# Altium project ThereMightBeNoise.PrjPCB (part 2 of 2)

## Sheet Power.SchDoc
size A3; Author: Danius Kalvaitis; Organization: Altium Limited; Address1: L3, 12a Rodborough Rd; Address2: Frenchs Forest; Address3: NSW; Address4: Australia 2086; DocumentNumber: 5; SheetNumber: 5; SheetTotal: 9
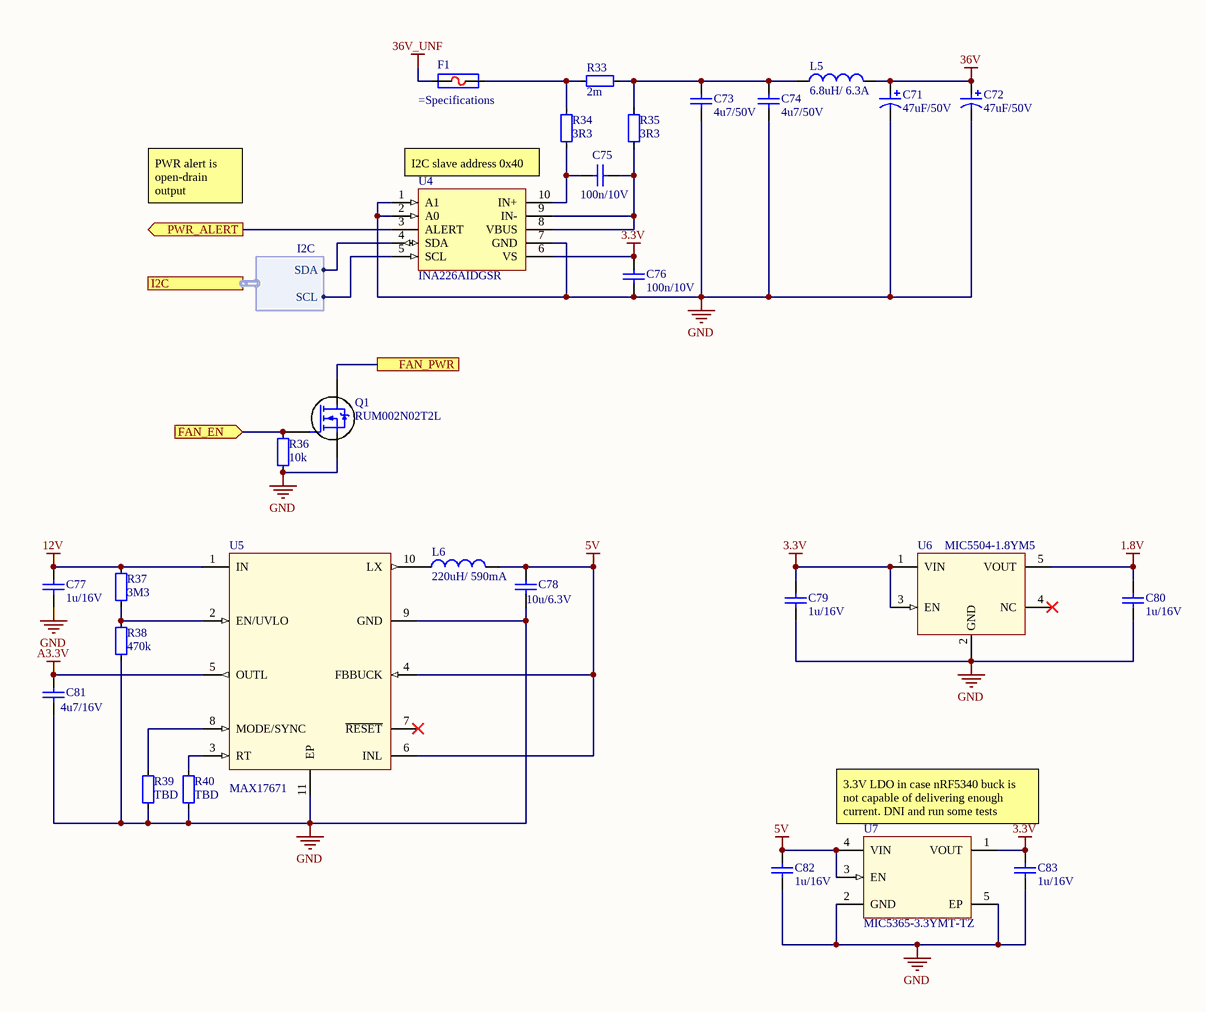
[diagram p6: Power.SchDoc]

### Parts
C71  47uF/50V  [WURTH-L6.5-D8]
C72  47uF/50V  [WURTH-L6.5-D8]
C73  4u7/50V  [C1210]
C74  4u7/50V  [C1210]
C75  100n/10V  [C0402]
C76  100n/10V  [C0402]
C77  1u/16V  [C0603]
C78  10u/6.3V  [C0805]
C79  1u/16V  [C0603]
C80  1u/16V  [C0603]
C81  4u7/16V  [C0805]
C82  1u/16V  [C0603]
C83  1u/16V  [C0603]
F1  (no value)  [F2512]
L5  6.8uH/ 6.3A  [SRR1260]
L6  220uH/ 590mA  [TYS6045221M-10]
Q1  RUM002N02T2L  [SOT-723-3]
R33  2m  [R1206]
R34  3R3  [R0402]
R35  3R3  [R0402]
R36  10k  [R0402]
R37  3M3  [R0402]
R38  470k  [R0402]
R39  TBD  [R0402]
R40  TBD  [R0402]
U4  INA226AIDGSR  [MSOP-10]
U5  MAX17671  [TDFN-10]
U6  MIC5504-1.8YM5  [SOT23-5]
U7  MIC5365-3.3YMT-TZ  [MLF-4]

### Ports
FAN_EN (in), FAN_PWR, I2C (harness I2C), PWR_ALERT (out)

### Harnesses
I2C: SCL, SDA

### Nets
1.8V: C80.2 U6.5(VOUT)
3.3V: C76.2 C79.2 C83.2 U4.6(VS) U6.1(VIN) U6.3(EN) U7.1(VOUT)
5V: C78.2 C82.2 L6.2 U5.4(FBBUCK) U5.6(INL) U7.3(EN) U7.4(VIN)
12V: C77.2 R37.2 U5.1(IN)
36V: C71.1 C72.1 L5.2
36V_UNF: F1.1
A3.3V: C81.2 U5.5(OUTL)
GND: C71.2 C72.2 C73.1 C74.1 C76.1 C77.1 C78.1 C79.1 C80.1 C81.1 C82.1 C83.1 Q1.2(S) R36.1 R38.1 R39.1 R40.1 U4.1(A1) U4.2(A0) U4.7(GND) U5.9(GND) U5.11(EP) U6.2(GND) U7.2(GND) U7.5(EP)
CODEC_GPIO: Q1.1(G) R36.2 ; port FAN_EN
FAN_PWR: Q1.3(D) ; port FAN_PWR
I2C.SCL: U4.5(SCL) ; port I2C.SCL
I2C.SDA: U4.4(SDA) ; port I2C.SDA
PWR_ALERT: U4.3(ALERT) ; port PWR_ALERT
NetC73_2: C73.2 C74.2 L5.1 R33.2 R35.2
NetC75_1: C75.1 R34.1 U4.10(IN+)
NetC75_2: C75.2 R35.1 U4.8(VBUS) U4.9(IN-)
NetF1_2: F1.2 R33.1 R34.2
NetL6_1: L6.1 U5.10(LX)
NetR37_1: R37.1 R38.2 U5.2(EN/UVLO)
NetR39_2: R39.2 U5.8(MODE/SYNC)
NetR40_2: R40.2 U5.3(RT)

Not connected (* = marked no-connect by the designer): U5 7(~{RESET})*; U6 4(NC)*

### Notes on the sheet
- I2C slave address 0x40
- PWR alert is open-drain output
- 3.3V LDO in case nRF5340 buck is not capable of delivering enough current. DNI and run some tests
- Title
- Date:
- Number:
- Revision:
- Sheet
- of
- File:
- Author

### Library data of the parts
C71 C72 = Wurth-47uF-50V-L6.5-D8: Aluminium Electrolytic Capacitors - SMD WCAP-ASLI 50V 47uF 20% ESR=690mOhms; Manufacturer Part Number 1: 865080649013; Manufacturer 1: Wurth Elektronik; Specifications: 47uF 50V ±20%; ComponentLink1Description: Datasheet; ComponentLink1URL: https://www.mouser.co.uk/datasheet/2/445/865080649013-1075240.pdf; Capacitance: 47uF; Voltage: 50V; Tolerance: 20%; Supplier 1: Mouser; Supplier Part Number 1: 710-865080649013
C73 C74 = 4u7 50V X7R 1210: Manufacturer Part Number 1: UMK325B7475KMHP; Manufacturer 1: Taiyo Yuden; Voltage: 50V; Tolerance: 10%; Specifications: X7R 4u7 50V ±10%; Capacitance: 4u7; Dielectric: X7R; Supplier 1: Mouser; Supplier Part Number 1: 963-UMK325B7475KMHP
C75 C76 = 100n 10V X5R 0402: Manufacturer Part Number 1: 885012105010; Manufacturer 1: Wurth Elektronik; Voltage: 10V; Tolerance: 20%; Specifications: X5R 100n 10V ±20%; Capacitance: 100n; Dielectric: X5R; Supplier 1: Mouser; Supplier Part Number 1: 710-885012105010
C77 C79 C80 C82 C83 = 1u 16V X7R 0603: Manufacturer Part Number 1: 885012206052; Manufacturer 1: Wurth Elektronik; Voltage: 16V; Tolerance: 10%; Specifications: X7R 1u 16V ±10%; Capacitance: 1u; Dielectric: X7R; Supplier 1: Mouser; Supplier Part Number 1: 710-885012206052
C78 = 10u 6V3 X7R 0805: Manufacturer Part Number 1: JMK212B7106KG-T; Manufacturer 1: Taiyo Yuden; Voltage: 6.3V; Tolerance: 10%; Specifications: X7R 10u 6.3V ±10%; Capacitance: 10u; Dielectric: X7R; Supplier 1: Mouser; Supplier Part Number 1: 963-JMK212B7106KG-T
C81 = 4u7 16V X7R 0805: Manufacturer Part Number 1: EMK212AB7475KGHT; Manufacturer 1: Taiyo Yuden; Voltage: 16V; Tolerance: 10%; Specifications: X7R 4u7 16V ±10%; Capacitance: 4u7; Dielectric: X7R; Supplier 1: Mouser; Supplier Part Number 1: 963-EMK212AB7475KGHT
F1 = 0451005.NRL: Surface Mount Fuses 125VAC 5A .0125ohms 451 NANO2; Manufacturer 1: Littlefuse; Specifications: Fast Blow 5A 125VDC; Voltage Rating: 125VDC; Fuse Type: Fast Blow; Current Rating: 5A; ComponentLink1Description: Datasheet; ComponentLink1URL: https://www.mouser.co.uk/datasheet/2/240/Littelfuse_Fuse_451_453_Datasheet_pdf-468354.pdf; Supplier 1: Mouser; Supplier Part Number 1: 576-0451005.NRL; Manufacturer Part Number 1: 0451005.NRL
L5 = SRR1260-6R8Y: Fixed Inductors 6.8uH 30% SMD 1260; Manufacturer 1: Bourns; Specifications: 6.8uH 6.3A 30%; ComponentLink1Description: Datasheet; ComponentLink1URL: https://www.mouser.co.uk/datasheet/2/54/rr1260-1391580.pdf; Inductance: 6.8uH; Tolerance: 30%; Current: 6.3A; Manufacturer Part Number: SRR1260-6R8Y; Supplier 1: Mouser; Supplier Part Number 1: 652-SRR1260-6R8Y; Manufacturer Part Number 1: SRR1260-6R8Y
L6 = TYS6045221M-10: Fixed Inductors 220uH 20% -40C +125C; Specifications: 220uH 590mA 20%; ComponentLink1Description: Datasheet; ComponentLink1URL: https://assets.lairdtech.com/home/brandworld/files/TYS6045221M-10.pdf; Current: 590mA; Inductance: 220uH; Manufacturer Part Number: TYS6045221M-10; Tolerance: 20%; Supplier 1: Mouser; Supplier Part Number 1: 875-TYS6045221M-10
Q1 = RUM002N02T2L: N-Channel 20V 200mA (Ta) 150mW (Ta) Surface Mount VMT3; Manufacturer 1: ROHM Semiconductor; On Resistance: 1.2Ohm; VGS: 2.5V; Specifications: N-Channel 200mA 2.5V; ComponentLink1Description: Datasheet; ComponentLink1URL: https://d1d2qsbl8m0m72.cloudfront.net/en/products/databook/datasheet/discrete/transistor/mosfet/rum002n02t2l-e.pdf; Supplier 1: Farnell; Supplier Part Number 1: 2706688; Manufacturer Part Number 1: RUM002N02T2L; Transistor Polarity: N-Channel; VDS: 20V; Drain Current: 200mA; Price @ 10k: 0.043
R33 = 2m 1W 100V 1206: Current Sense Resistors - SMD 1W 0.002 OHMS 1%; Manufacturer Part Number 1: PCS1206FR0020ET; Manufacturer 1: Ohmite; Voltage: 100V; Power Rating: 1W; Tolerance: 1%; Resistance: 2m; Specifications: =Resistance+ ' '+"Power Rating "+Voltage+' ±'+Tolerance; Supplier 1: Mouser; Supplier Part Number 1: 588-PCS1206FR0020ET
R34 R35 = 3R3 100mW 50V 0402: Manufacturer Part Number 1: RK73H1ETTP3R30F; Manufacturer 1: KOA Speer; Power Rating: 100mW; Tolerance: 1%; Voltage: 50V; Resistance: 3R3; Specifications: =Resistance+ ' '+"Power Rating "+Voltage+' ±'+Tolerance; Supplier 1: Mouser; Supplier Part Number 1: 660-RK73H1ETTP3R30F
R36 = 10k 63mW 50V 0402: Manufacturer Part Number 1: AC0402FR-0710KL; Manufacturer 1: Yageo; Power Rating: 63mW; Tolerance: 1%; Voltage: 50V; Resistance: 10k; Specifications: =Resistance+ ' '+"Power Rating "+Voltage+' ±'+Tolerance; Supplier 1: Mouser; Supplier Part Number 1: 603-AC0402FR-0710KL
R37 = 3M3 63mW 50V 0402: Manufacturer Part Number 1: RC0402FR-073M3L; Manufacturer 1: Yageo; Power Rating: 63mW; Tolerance: 1%; Voltage: 50V; Resistance: 3M3; Specifications: =Resistance+ ' '+"Power Rating "+Voltage+' ±'+Tolerance; Supplier 1: Mouser; Supplier Part Number 1: 603-RC0402FR-073M3L
R38 = 470k 63mW 50V 0402: Manufacturer Part Number 1: CRCW0402470KFKEDC; Manufacturer 1: Vishay; Power Rating: 63mW; Tolerance: 1%; Voltage: 50V; Resistance: 470k; Specifications: =Resistance+ ' '+"Power Rating "+Voltage+' ±'+Tolerance; Supplier 1: Mouser; Supplier Part Number 1: 71-CRCW0402470KFKEDC
R39 R40 = R TBD 0402: Power Rating: ?W; Tolerance: ?%; Voltage: ?V; Resistance: TBD; Specifications: =Resistance+ ' '+"Power Rating "+Voltage+' ±'+Tolerance; Manufacturer Part Number 1: *; Supplier 1: *; Supplier Part Number 1: *; Manufacturer 1: *
U4 = INA226AIDGSR: Current & Power Monitors & Regulators Hi-Side Msmt,Bi-Dir Current/Pwr Mon; Manufacturer 1: Texas Instruments; Manufacturer Part Number 1: INA226AIDGSR; ComponentLink1Description: Datasheet; ComponentLink1URL: https://www.ti.com/lit/ds/symlink/ina226.pdf?ts=1603639828140&ref_url=https%253A%252F%252Fwww.google.com%252F; Supplier 1: Mouser; Supplier Part Number 1: 595-INA226AIDGSR; Supplier 2: Ebay; Supplier Part Number 2: https://www.ebay.com/itm/292413947140?hash=item44153abd04:g:KkcAAOSwup1bzJJs&amdata=enc%3AAQAHAAAA4PdI6VXDLYAPJFEXmHZi1ThRRON26MnYbdmjJKT%2F0dK%2F7GWelxmov%2FVYVmcGdieuIJzLqoO%2BD%2BHoggpZhgSPH2ZVvivlAlKuwXud9ILDOUiWmm8vxYRrJ9Jz0bi6RVpucmt8w%2BX2ZyMTawRkpNpetfg6BauLy6FlRyyJmdkYQj6gMVZhbwIoMXc2muNY31f1spp9JTpkgCNr%2FzVU18zPTNn%2Bsj68HkPpNiej54P62RECWmDMvztQzE4azF%2BaI%2FZmXqVSyvKASGqyPNlrq8T800cfpcDTEwQMdI6ngCFQHQZh%7Ctkp%3ABFBM_u7FtONg
U5 = MAX17671: Switching Voltage Regulators 4.5V - 60V, 150mA Synchronous DC-DC and 5V, 50mA low noise LDO; Manufacturer Part Number: MAX17671FATB+; Manufacturer 1: Maxim; Supplier 1: Mouser; Supplier Part Number 1: 700-MAX17671FATB+; ComponentLink1Description: Datasheet; ComponentLink1URL: https://www.mouser.co.uk/datasheet/2/256/MAX17671-1395932.pdf; Manufacturer Part Number 1: MAX17671FATB+
U6 = MIC5504-1.8YM5: LDO Voltage Regulators Single 300mA LDO with Enable Pull-Down & Auto Discharge; Manufacturer Part Number: MIC5504-1.8YM5-TR; Manufacturer 1: Microchip; ComponentLink1Description: Datasheet; ComponentLink1URL: https://www.mouser.co.uk/datasheet/2/268/MIC550X-1082389.pdf; Supplier 1: Mouser; Supplier Part Number 1: 998-MIC5504-1.8YM5TR; Manufacturer Part Number 1: MIC5504-1.8YM5-TR
U7 = MIC5365-3.3YMT-TZ: LDO Voltage Regulators Ultra Small Single 150mA LDO; Manufacturer 1: Microchip Technology / Atmel; Manufacturer Part Number 1: MIC5365-3.3YMT-TZ; ComponentLink1Description: Datasheet; ComponentLink1URL: https://eu.mouser.com/datasheet/2/268/mic5365-1082359.pdf; Supplier 1: Mouser; Supplier Part Number 1: 998-MIC5365-3.3YMTTZ

## Sheet UI.SchDoc
size A3; DocumentNumber: 6; SheetNumber: 6; SheetTotal: 9
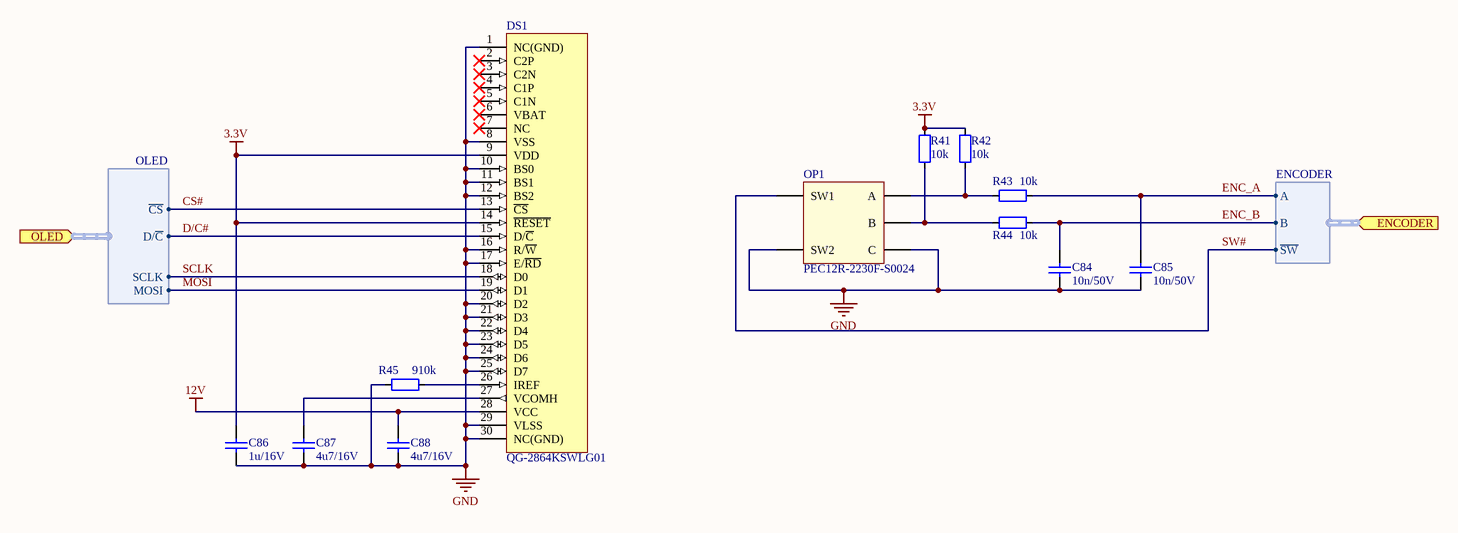
[diagram p7: UI.SchDoc]

### Parts
C84  10n/50V  [C0402]
C85  10n/50V  [C0402]
C86  1u/16V  [C0603]
C87  4u7/16V  [C0805]
C88  4u7/16V  [C0805]
DS1  QG-2864KSWLG01  [QG-2864KSWLG01]
OP1  PEC12R-2230F-S0024  [PEC12R-2x30F-Sxxxx]
R41  10k  [R0402]
R42  10k  [R0402]
R43  10k  [R0402]
R44  10k  [R0402]
R45  910k  [R0402]

### Ports
ENCODER (in, harness ENCODER), OLED (in, harness OLED)

### Harnesses
OLED: ~{CS}, D/~{C}, SCLK, MOSI
ENCODER: A, B, ~{SW}

### Nets
3.3V: C86.2 DS1.9(VDD) DS1.14(~{RESET}) R41.2 R42.2
12V: C88.2 DS1.28(VCC)
GND: C84.1 C85.1 C86.1 C87.1 C88.1 DS1.1(NC(GND)) DS1.8(VSS) DS1.10(BS0) DS1.11(BS1) DS1.12(BS2) DS1.16(R/~{W}) DS1.17(E/~{RD}) DS1.20(D2) DS1.21(D3) DS1.22(D4) DS1.23(D5) DS1.24(D6) DS1.25(D7) DS1.29(VLSS) DS1.30(NC(GND)) OP1.2(SW2) OP1.C R45.1
CS#: DS1.13(~{CS}) ; port OLED.~{CS}  [project net OLED.~{CS}]
D/C#: DS1.15(D/~{C}) ; port OLED.D/~{C}  [project net OLED.D/~{C}]
ENC_A: C85.2 R43.2 ; port ENCODER.A  [project net ENCODER.A]
ENC_B: C84.2 R44.2 ; port ENCODER.B  [project net ENCODER.B]
MOSI: DS1.19(D1) ; port OLED.MOSI  [project net OLED.MOSI]
SCLK: DS1.18(D0) ; port OLED.SCLK  [project net OLED.SCLK]
SW#: OP1.1(SW1) ; port ENCODER.~{SW}  [project net ENCODER.~{SW}]
NetC87_2: C87.2 DS1.27(VCOMH)
NetDS1_26: DS1.26(IREF) R45.2
NetOP1_A: OP1.A R42.1 R43.1
NetOP1_B: OP1.B R41.1 R44.1

Not connected (* = marked no-connect by the designer): DS1 2(C2P)* 3(C2N)* 4(C1P)* 5(C1N)* 6(VBAT)* 7(NC)*

### Notes on the sheet
- Title
- Date:
- Number:
- Revision:
- Sheet
- of
- File:
- Author

### Library data of the parts
C84 C85 = 10n 50V X7R 0402: Manufacturer Part Number 1: 885012205067; Manufacturer 1: Wurth Elektronik; Voltage: 50V; Tolerance: 10%; Specifications: X7R 10n 50V ±10%; Capacitance: 10n; Dielectric: X7R; Supplier 1: Mouser; Supplier Part Number 1: 710-885012205067
C86 = 1u 16V X7R 0603: as C77 on sheet Power; Supplier 1: Mouser; Supplier Part Number 1: 710-885012206052
C87 C88 = 4u7 16V X7R 0805: as C81 on sheet Power; Supplier 1: Mouser; Supplier Part Number 1: 963-EMK212AB7475KGHT
DS1 = QG-2864KSWLG01: OLED, 1.3-inch, 128x64, SPI; Manufacturer 1: Allvision Technology; Manufacturer Part Number: QG-2864KSWLG01; ComponentLink1Description: Datasheet; ComponentLink1URL: http://support.technologicalarts.ca/docs/Components/OLED13-SPI/1.3%20oled%20datasheet.pdf; Manufacturer Part Number 1: QG-2864KSWLG01
OP1 = PEC12R-2230F-S0024: Rotary Encoder Mechanical 24 Quadrature (Incremental) Right Angle; Manufacturer 1: Bourns; ComponentLink1Description: Datasheet; ComponentLink1URL: https://www.bourns.com/docs/Product-Datasheets/PEC12R.pdf; Supplier 1: Mouser; Supplier Part Number 1: 652-PEC12R-2230F-S24; Manufacturer Part Number 1: PEC12R-2230F-S0024
R41-R44 = 10k 63mW 50V 0402: as R36 on sheet Power; Resistance: 10k; Specifications: =Resistance+ ' '+"Power Rating "+Voltage+' ±'+Tolerance; Supplier 1: Mouser; Supplier Part Number 1: 603-AC0402FR-0710KL
R45 = 910k 63mW 50V 0402: Manufacturer Part Number 1: CRCW0402910KJNED; Manufacturer 1: Vishay; Power Rating: 63mW; Tolerance: 5%; Voltage: 50V; Resistance: 910k; Specifications: =Resistance+ ' '+"Power Rating "+Voltage+' ±'+Tolerance; Supplier 1: Mouser; Supplier Part Number 1: 71-CRCW0402910KJNED

## Sheet USBCharger.SchDoc
size A3; DocumentNumber: 9; SheetNumber: 9; SheetTotal: 9
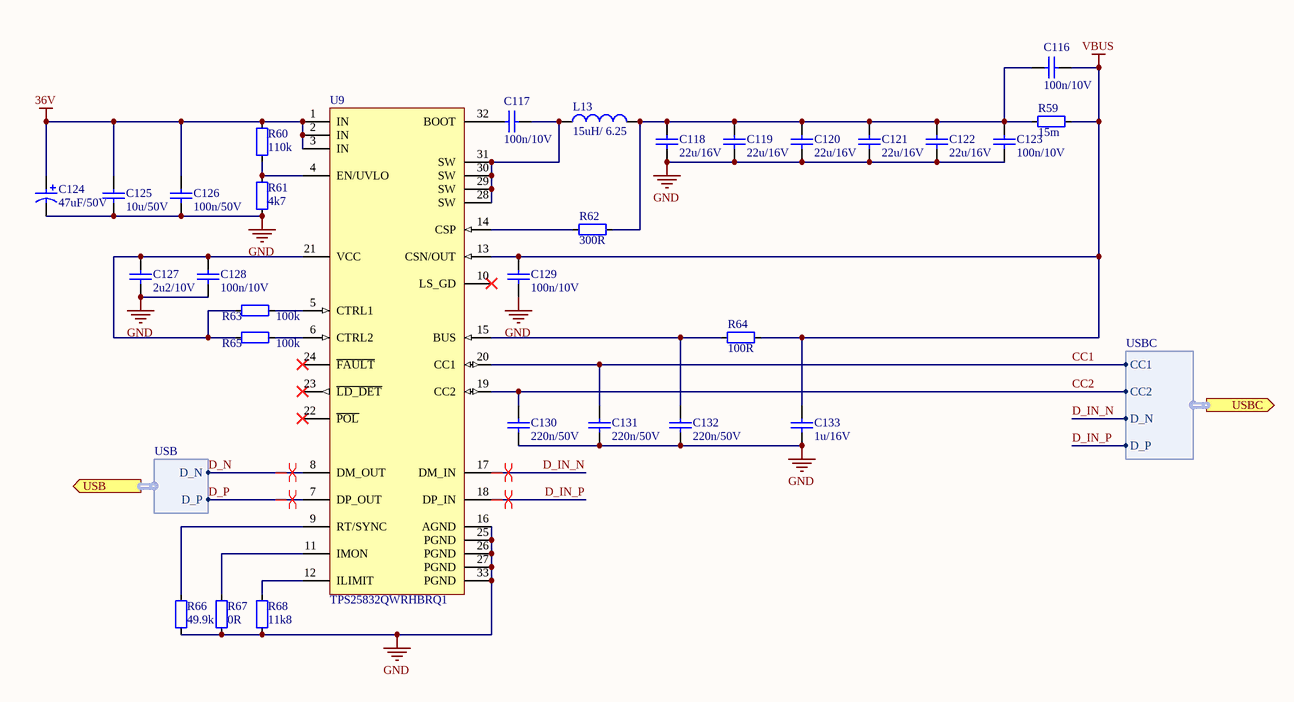
[diagram p8: USBCharger.SchDoc]

### Parts
C116  100n/10V  [C0402]
C117  100n/10V  [C0402]
C118  22u/16V  [C1210]
C119  22u/16V  [C1210]
C120  22u/16V  [C1210]
C121  22u/16V  [C1210]
C122  22u/16V  [C1210]
C123  100n/10V  [C0402]
C124  47uF/50V  [WURTH-L6.5-D8]
C125  10u/50V  [C1210]
C126  100n/50V  [C0603]
C127  2u2/10V  [C0603]
C128  100n/10V  [C0402]
C129  100n/10V  [C0402]
C130  220n/50V  [C0603]
C131  220n/50V  [C0603]
C132  220n/50V  [C0603]
C133  1u/16V  [C0603]
L13  15uH/ 6.25  [PA4342.XXXNLT]
R59  15m  [R1206]
R60  110k  [R0402]
R61  4k7  [R0402]
R62  300R  [R0402]
R63  100k  [R0402]
R64  100R  [R0402]
R65  100k  [R0402]
R66  49.9k  [R0402]
R67  0R  [R0402]
R68  11k8  [R0402]
U9  TPS25832QWRHBRQ1  [VQFN-32]

### Ports
USB (out, harness USB), USBC (out, harness USBC)

### Harnesses
USBC: CC1, CC2, D_N, D_P
USB: D_N, D_P

### Nets
36V: C124.1 C125.2 C126.2 R60.2 U9.1(IN) U9.2(IN) U9.3(IN)
GND: C118.1 C119.1 C120.1 C121.1 C122.1 C123.1 C124.2 C125.1 C126.1 C127.1 C128.1 C129.1 C130.1 C131.1 C132.1 C133.1 R61.1 R66.1 R67.1 R68.1 U9.16(AGND) U9.25(PGND) U9.26(PGND) U9.27(PGND) U9.33(PGND)
VBUS: C116.2 C129.2 C133.2 R59.2 R64.2 U9.13(CSN/OUT)
CC1: C131.2 U9.20(CC1) ; port USBC.CC1
CC2: C130.2 U9.19(CC2) ; port USBC.CC2
D_IN_N: U9.17(DM_IN) ; port USBC.D_N
D_IN_P: U9.18(DP_IN) ; port USBC.D_P
D_N: U9.8(DM_OUT) ; port USB.D_N  [project net USB.D_N]
D_P: U9.7(DP_OUT) ; port USB.D_P  [project net USB.D_P]
NetC116_1: C116.1 C118.2 C119.2 C120.2 C121.2 C122.2 C123.2 L13.2 R59.1 R62.2
NetC117_1: C117.1 U9.32(BOOT)
NetC117_2: C117.2 L13.1 U9.28(SW) U9.29(SW) U9.30(SW) U9.31(SW)
NetC127_2: C127.2 C128.2 R63.1 R65.1 U9.21(VCC)
NetC132_2: C132.2 R64.1 U9.15(BUS)
NetR60_1: R60.1 R61.2 U9.4(EN/UVLO)
NetR62_1: R62.1 U9.14(CSP)
NetR63_2: R63.2 U9.5(CTRL1)
NetR65_2: R65.2 U9.6(CTRL2)
NetR66_2: R66.2 U9.9(RT/SYNC)
NetR67_2: R67.2 U9.11(IMON)
NetR68_2: R68.2 U9.12(ILIMIT)

Not connected (* = marked no-connect by the designer): U9 10(LS_GD)* 22(~{POL})* 23(~{LD_DET})* 24(~{FAULT})*

### Layout directives
differential pair: D_IN_N, D_IN_P, USB.D_N, USB.D_P

### Notes on the sheet
- Title
- Date:
- Number:
- Revision:
- Sheet
- of
- File:
- Author

### Library data of the parts
C116 C117 C123 C128 C129 = 100n 10V X5R 0402: as C75 on sheet Power; Supplier 1: Mouser; Supplier Part Number 1: 710-885012105010
C118-C122 = 22u 16V X7R 1210: Manufacturer Part Number 1: GCM32ER71C226ME19K; Manufacturer 1: Murata; Voltage: 16V; Tolerance: 20%; Specifications: X7R 22u 16V ±20%; Capacitance: 22u; Dielectric: X7R; Supplier 1: Mouser; Supplier Part Number 1: 81-GCM32ER71C226ME9K
C124 = Wurth-47uF-50V-L6.5-D8: as C71 on sheet Power; ComponentLink1Description: Datasheet; ComponentLink1URL: https://www.mouser.co.uk/datasheet/2/445/865080649013-1075240.pdf; Capacitance: 47uF; Voltage: 50V; Tolerance: 20%; Supplier 1: Mouser; Supplier Part Number 1: 710-865080649013
C125 = 10u 50V X5R 1210: Manufacturer Part Number 1: UMK325BJ106KM-T; Manufacturer 1: TAIYO YUDEN; Voltage: 50V; Tolerance: 10%; Specifications: X5R 10u 50V ±10%; Capacitance: 10u; Dielectric: X5R; Supplier 1: Farnell; Supplier Part Number 1: 2113078
C126 = 100n 50V X7R 0603: Manufacturer Part Number 1: C0603C104M5RACTU; Manufacturer 1: KEMET; Voltage: 50V; Tolerance: 20%; Specifications: X7R 100n 50V ±20%; Capacitance: 100n; Dielectric: X7R; Supplier 1: Mouser; Supplier Part Number 1: 80-C0603C104M5R
C127 = 2u2 10V X5R 0603: Manufacturer Part Number 1: CL10A225KP8NNNC; Manufacturer 1: SAMSUNG ELECTRO-MECHANICS; Voltage: 10V; Tolerance: 10%; Specifications: X5R 2u2 10V ±10%; Capacitance: 2u2; Dielectric: X5R; Supplier 1: Farnell; Supplier Part Number 1: 3013393
C130-C132 = 220n 50V X7R 0603: Manufacturer Part Number 1: GCM188R71H224KA64D; Manufacturer 1: MURATA; Voltage: 50V; Tolerance: 10%; Specifications: X7R 220n 50V ±10%; Capacitance: 220n; Dielectric: X7R; Supplier 1: Farnell; Supplier Part Number 1: 2456085
C133 = 1u 16V X7R 0603: as C77 on sheet Power; Supplier 1: Mouser; Supplier Part Number 1: 710-885012206052
L13 = PA4342.153NLT: Fixed Inductors 15uH 6.25A 4mm 20% Low Prof; Manufacturer 1: Pulse Electronics; Current: 6.25; Specifications: 15uH 6.25 20%; ComponentLink1Description: Datasheet; Inductance: 15uH; Tolerance: 20%; Manufacturer Part Number 1: PA4342.153NLT; Supplier 1: Mouser; Supplier Part Number 1: 673-PA4342.153NLT
R59 = 15m 1W 100V 1206: Manufacturer Part Number 1: WW12RR015FTL; Manufacturer 1: WALSIN; Power Rating: 1W; Tolerance: 1%; Voltage: 100V; Resistance: 15m; Specifications: =Resistance+ ' '+"Power Rating "+Voltage+' ±'+Tolerance; Supplier 1: Farnell; Supplier Part Number 1: 2503045
R60 = 110k 63mW 50V 0402: Manufacturer Part Number 1: MCWR04X1103FTL; Manufacturer 1: MULTICOMP PRO; Power Rating: 63W; Tolerance: 1%; Voltage: 50V; Resistance: 110k; Specifications: =Resistance+ ' '+"Power Rating "+Voltage+' ±'+Tolerance; Supplier 1: Farnell; Supplier Part Number 1: 2447099
R61 = 4k7 63mW 50V 0402: Manufacturer Part Number 1: AC0402FR-134K7L; Manufacturer 1: Yageo; Power Rating: 63mW; Tolerance: 1%; Voltage: 50V; Resistance: 4k7; Specifications: =Resistance+ ' '+"Power Rating "+Voltage+' ±'+Tolerance; Supplier 1: Mouser; Supplier Part Number 1: 603-AC0402FR-134K7L
R62 = 300R 63mW 50V 0402: Manufacturer Part Number 1: MCMR04X3000FTL; Manufacturer 1: MULTICOMP PRO; Power Rating: 63mW; Tolerance: 1%; Voltage: 50V; Resistance: 300R; Specifications: =Resistance+ ' '+"Power Rating "+Voltage+' ±'+Tolerance; Supplier 1: Farnell; Supplier Part Number 1: 2072893
R63 R65 = 100k 63mW 50V 0402: Manufacturer Part Number 1: AC0402FR-07100KL; Manufacturer 1: Yageo; Power Rating: 63mW; Tolerance: 1%; Voltage: 50V; Resistance: 100k; Specifications: =Resistance+ ' '+"Power Rating "+Voltage+' ±'+Tolerance; Supplier 1: Mouser; Supplier Part Number 1: 603-AC0402FR-07100KL
R64 = 100R 63mW 50V 0402: Manufacturer Part Number 1: MCWR04X1000FTL; Manufacturer 1: MULTICOMP PRO; Power Rating: 63mW; Tolerance: 1%; Voltage: 50V; Resistance: 100R; Specifications: =Resistance+ ' '+"Power Rating "+Voltage+' ±'+Tolerance; Supplier 1: Farnell; Supplier Part Number 1: 2447095
R66 = 49k9 63mW 50V 0402: Manufacturer Part Number 1: CRCW040249K9FKEDC; Manufacturer 1: Vishay; Power Rating: 63mW; Tolerance: 1%; Voltage: 50V; Resistance: 49.9k; Specifications: =Resistance+ ' '+"Power Rating "+Voltage+' ±'+Tolerance; Supplier 1: Mouser; Supplier Part Number 1: 71-CRCW040249K9FKEDC
R67 = 0R 63mW 50V 0402: Manufacturer Part Number 1: CRCW04020000Z0EDC; Manufacturer 1: Vishay; Power Rating: 63mW; Tolerance: 1%; Voltage: 50V; Resistance: 0R; Specifications: =Resistance+ ' '+"Power Rating "+Voltage+' ±'+Tolerance; Supplier 1: Mouser; Supplier Part Number 1: 71-CRCW04020000Z0EDC
R68 = 11k8 63mW 50V 0402: Manufacturer Part Number 1: MCWR04X1182FTL; Manufacturer 1: MULTICOMP PRO; Power Rating: 63mW; Tolerance: 1%; Voltage: 50V; Resistance: 11k8; Specifications: =Resistance+ ' '+"Power Rating "+Voltage+' ±'+Tolerance; Supplier 1: Farnell; Supplier Part Number 1: 2694536
U9 = TPS25832QWRHBRQ1: USB Interface IC USB Type-C and SDP/CDP charge port converter with cable compensation 32-VQFN -40 to 125; Manufacturer 1: Texas Instruments; Manufacturer Part Number 1: TPS25832QWRHBRQ1; Supplier 1: Mouser; Supplier Part Number 1: 595-TPS25832QWRHBRQ1; ComponentLink1Description: Datasheet; ComponentLink1URL: https://www.ti.com/lit/ds/symlink/tps25832-q1.pdf; Supplier 2: Mouser; Supplier Part Number 2: 595-PS25832AQWRHBRQ1

## Nets that join several sheets
1.8V: Codec (C35.2 C36.2 U2.36), Power (C80.2 U6.5)
3.3V: Microcontroller (J13.6 J14.1 R48.2 R49.2), nRF5340 (29 pins), Codec (C40.2 C41.2 U2.33 U2.44), Power (7 pins), UI (5 pins)
5V: nRF5340 (C108.2 U8.E1), Connectors (C66.2 J5.8), Power (7 pins)
12V: Connectors (5 pins), Amplifier (5 pins), Power (C77.2 R37.2 U5.1), UI (C88.2 DS1.28)
36V: Amplifier (12 pins), Power (C71.1 C72.1 L5.2), USBCharger (7 pins)
36V_UNF: Connectors (J1.1 J1.2 J1.3), Power (F1.1)
A3.3V: Codec (C39.2 FB1.1 FB2.1), Power (C81.2 U5.5)
GND: Microcontroller (C114.2 C115.1 J13.5 J14.2), nRF5340 (32 pins), Connectors (24 pins), Codec (30 pins), Amplifier (39 pins), Power (25 pins), UI (23 pins), USBCharger (25 pins)
VBUS: nRF5340 (R47.1), Connectors (C61.2 FB3.2), USBCharger (6 pins)
AMP_FAULT#: nRF5340 (U8.U31), Amplifier (U1.4)
AMP_OTW_CLIP#: nRF5340 (U8.R31), Amplifier (U1.2)
AMP_RST#: nRF5340 (U8.AE31), Amplifier (U1.5)
CC1: Connectors (J2.A5), USBCharger (C131.2 U9.20)
CC2: Connectors (J2.B5), USBCharger (C130.2 U9.19)
CODEC_GPIO: Codec (U2.34), Power (Q1.1 R36.2)
CODEC_INT: nRF5340 (U8.AK30), Codec (U2.35)
D_IN_N: Connectors (J2.A7 J2.B7 U3.2), USBCharger (U9.17)
D_IN_P: Connectors (J2.A6 J2.B6 U3.3), USBCharger (U9.18)
ENCODER.A: Microcontroller (R56.1), nRF5340 (U8.AL9), UI (C85.2 R43.2)
ENCODER.B: nRF5340 (U8.AL5), UI (C84.2 R44.2)
ENCODER.~{SW}: nRF5340 (U8.A17), UI (OP1.1)
FAN_PWR: Connectors (J4.1), Power (Q1.3)
I2C.SCL: Microcontroller (R48.1), nRF5340 (U8.AL15), Connectors (J5.5), Codec (U2.1), Power (U4.5)
I2C.SDA: Microcontroller (R49.1), nRF5340 (U8.AL13), Connectors (J5.6), Codec (U2.2), Power (U4.4)
I2S.BCLK: Microcontroller (R53.1), Codec (U2.38)
I2S.DIN: Microcontroller (R57.1), Codec (U2.40)
I2S.DOUT: nRF5340 (U8.AL19), Codec (R28.1)
I2S.MCLK: Microcontroller (R54.1), Codec (U2.37)
I2S.WCLK: Microcontroller (R58.1), Codec (U2.39)
INL: Connectors (J11.2 J11.5), Codec (R23.1)
INL_N: Connectors (J9.3), Codec (R19.1)
INL_P: Connectors (J9.2), Codec (R14.1)
INR: Connectors (J11.3), Codec (R24.1)
INR_N: Connectors (J6.3), Codec (R13.1)
INR_P: Connectors (J6.2), Codec (R9.1)
MIC: Connectors (J11.4), Codec (R21.1 U2.12)
NetC8_1: Codec (C53.2 R17.2), Amplifier (C8.1)
NetC11_1: Codec (C53.1 R20.2), Amplifier (C11.1)
NetC16_1: Codec (C57.2 R22.2), Amplifier (C16.1)
NetC20_1: Codec (C57.1 R25.2), Amplifier (C20.1)
NFC.NFC1: Microcontroller (C114.1), nRF5340 (U8.W1), Connectors (J5.2)
NFC.NFC2: Microcontroller (C115.2), nRF5340 (U8.AA1), Connectors (J5.3)
OLED.~{CS}: Microcontroller (R50.1), UI (DS1.13)
OLED.D/~{C}: Microcontroller (R55.1), UI (DS1.15)
OLED.MOSI: Microcontroller (R51.1), UI (DS1.19)
OLED.SCLK: Microcontroller (R52.1), UI (DS1.18)
OUTL_N: Connectors (J12.1), Amplifier (C22.1 C23.1 C25.1 L4.2)
OUTL_P: Connectors (J10.1), Amplifier (C14.2 C17.2 C18.2 L3.2)
OUTR_N: Connectors (J8.1), Amplifier (C9.1 C10.1 C13.1 L2.2)
OUTR_P: Connectors (J7.1), Amplifier (C3.2 C4.2 C5.2 L1.2)
P0.00/XL1: Microcontroller (R51.2), nRF5340 (U8.N1)
P0.01/XL2: Microcontroller (R52.2), nRF5340 (U8.R1)
P0.09: Microcontroller (R50.2), nRF5340 (U8.AJ1)
P0.24: Microcontroller (R53.2), nRF5340 (U8.AL27)
P0.26/AIN5: Microcontroller (R54.2), nRF5340 (U8.AL29)
P1.02/I2C: Microcontroller (R55.2), nRF5340 (U8.AE1)
P1.06: Microcontroller (R57.2), nRF5340 (U8.AL21)
P1.08: Microcontroller (R58.2), nRF5340 (U8.AL23)
PWR_ALERT: nRF5340 (U8.AK2), Power (U4.3)
SWC: Microcontroller (J13.2 J14.3), nRF5340 (U8.W31)
SWD: Microcontroller (J13.1 J14.4), nRF5340 (U8.AA31)
USB.D_N: nRF5340 (U8.B4), USBCharger (U9.8)
USB.D_P: nRF5340 (U8.B2), USBCharger (U9.7)

## Assembly variants
Default: not fitted C60 C61 J6 R1 R28 R34 R35 U4; alternate parts Y2 -> XRCGB32M000F2P2CR0